# Altium schematic sheet ExternalDisplay.SchDoc
size A4; SheetNumber: 5; SheetTotal: 5
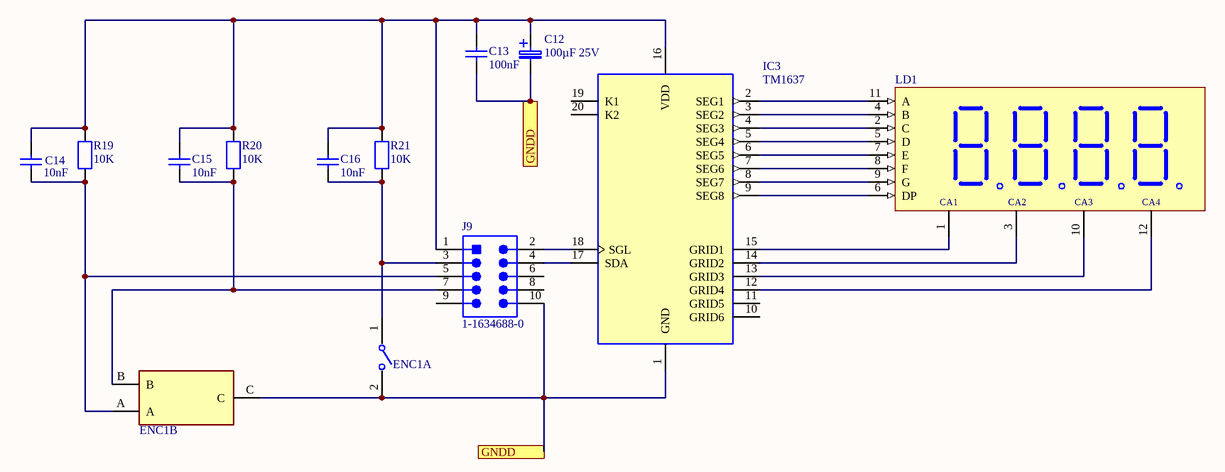
[diagram p0: ExternalDisplay.SchDoc]

## Parts
C12  100µF 25V  [TAP106M050BRW]
C13  100nF  [CAPC2012X88N]
C14  10nF  [CAPC2012X88N]
C15  10nF  [CAPC2012X88N]
C16  10nF  [CAPC2012X88N]
ENC1  PEC11R-4220F-S0012  [PEC11R_4220F_S0012]  (value not drawn)  (parts A,B of 2)
IC3  TM1637  [N-20]
J9  1-1634688-0  [TECO-1-1634688-0-10_V]
LD1  KW4-801AVB  [KW4-801AVB/KW4-801CVB]  (value not drawn)
R19  10K  [RESC2012X50N]
R20  10K  [RESC2012X50N]
R21  10K  [RESC2012X50N]

## Ports
GNDD (see ExternalDisplay[2B]), GNDD (see ExternalDisplay[2C])

## Nets
GNDD: C12.2 C13.1 ENC1.2 ENC1.C IC3.1(GND) J9.10 ; port GNDD
NetC12_1: C12.1 C13.2 C14.2 C15.2 C16.2 IC3.16(VDD) J9.1 R19.2 R20.2 R21.2
NetC14_1: C14.1 ENC1.A J9.5 R19.1
NetC15_1: C15.1 ENC1.B J9.7 R20.1
NetC16_1: C16.1 ENC1.1 J9.3 R21.1
NetIC3_2: IC3.2(SEG1) LD1.11(A)
NetIC3_3: IC3.3(SEG2) LD1.4(B)
NetIC3_4: IC3.4(SEG3) LD1.2(C)
NetIC3_5: IC3.5(SEG4) LD1.5(D)
NetIC3_6: IC3.6(SEG5) LD1.7(E)
NetIC3_7: IC3.7(SEG6) LD1.8(F)
NetIC3_8: IC3.8(SEG7) LD1.9(G)
NetIC3_9: IC3.9(SEG8) LD1.6(DP)
NetIC3_12: IC3.12(GRID4) LD1.12
NetIC3_13: IC3.13(GRID3) LD1.10
NetIC3_14: IC3.14(GRID2) LD1.3
NetIC3_15: IC3.15(GRID1) LD1.1(CA1)
NetIC3_17: IC3.17(SDA) J9.4
NetIC3_18: IC3.18(SGL) J9.2

Not connected (* = marked no-connect by the designer): IC3 10(GRID6) 11(GRID5) 19(K1) 20(K2); J9 6 8 9

## Notes on the sheet
- (in symbol KW4-801AVB) CA2; CA3; CA4

## Library data of the parts
C12 = capacitor THT radial tantalum: Tantalum Capacitors - Solid Leaded 50V 10uF 20% ESR=1.6 Ohm TAP106M050BRW; Manufacturer_Name: Kyocera AVX; Geometry.Height: 15.5mm; Mouser Part Number: 581-TAP106M050BRW; Mouser Price/Stock: https://www.mouser.co.uk/ProductDetail/AVX/TAP106M050BRW?qs=GjEaAqXp9rZGx11KfVU76g%3D%3D; Manufacturer_Part_Number: TAP106M050BRW; Datasheet Link: https://www.mouser.be/datasheet/2/40/tap-776819.pdf
C13-C16 = Capacitor ceramic 0805: Manufacturer: Kemet; Part Number: C0402C104K4RACTU
ENC1 = PEC11R-4220F-S0012: ROTARY ENCODER MECHANICAL 12PPR; Built in Switch: Yes; Number of Channels: 2; Output Type: Quadrature; Hole Diameter: 7mm; Pulses per Revolution: 12; Termination: PC Pin; Package Quantity: 150; RoHS Compliant: Yes; Mount: Through Hole; Width: 12.5mm; Radiation Hardening: No; Number of Pins: 5; REACH SVHC: No SVHC; Type: Mechanical; Packaging: Bulk; Min Operating Temperature: -30°C; Encoder Type: Mechanical; Height: 13.4mm; Length: 26.5mm; Orientation: Vertical; Max Operating Temperature: 70°C; Series: PEC11R; Detent: Yes
IC3 = TM1637: LED Drive Control Special Circuit; MF: Titan Micro Electronics; Package: Package; Availability: Not in stock; SnapEDA_Link: https://www.snapeda.com/parts/TM1637/Titan+Micro+Electronics/view-part/?ref=snap; MP: TM1637; Check_prices: https://www.snapeda.com/parts/TM1637/Titan+Micro+Electronics/view-part/?ref=eda; Value: *; Price: None
J9 = pin header 2X5 10pins: CMP-2000-05854-1 Male Header, Pitch 2.54 mm, 2 x 5 Postion, Height 9.15 mm, Tail Length 3.2 mm, -40 to 105 degC, RoHS, Bulk; Manufacturer: TE Connectivity; No. of Rows: 2; SVHC: ToBeAdvised; Package Version: Rev. C2, 02/2011; No. of Contacts: 10Contacts; Pitch: 2.54mm; No. of Positions: 10; Contact Termination Type: ThroughHole; Package Description: 10-Pin Connector, Body 20.35 x 8.7 mm, Pitch 2.54 mm; Orientation: Straight; Gender: Header; Mounting Technology: ThroughHole; Product Range: -; PartNumber: 1-1634688-0; Datasheet Version: Rev. C2, 02/2011; Contact Material: Brass; Package URL: https://datasheet.ciiva.com/6831/eng-cd-1634688-c2-6831201.pdf; Package Reference: 1-1634688-0; Pitch Spacing: 2.54mm; Contact Plating: GoldPlatedContacts; Manufacturer URL: http://www.te.com/; Datasheet URL: https://datasheet.ciiva.com/6831/eng-cd-1634688-c2-6831201.pdf
LD1 = KW4-801AVB: 4-Digit LED Display TME
R19-R21 = resistor 0805: Manufacturer: Vishay Dale; Part Number: CRCW08050000Z0EA